# Altium schematic sheet sensors-ssm.SchDoc
size A4
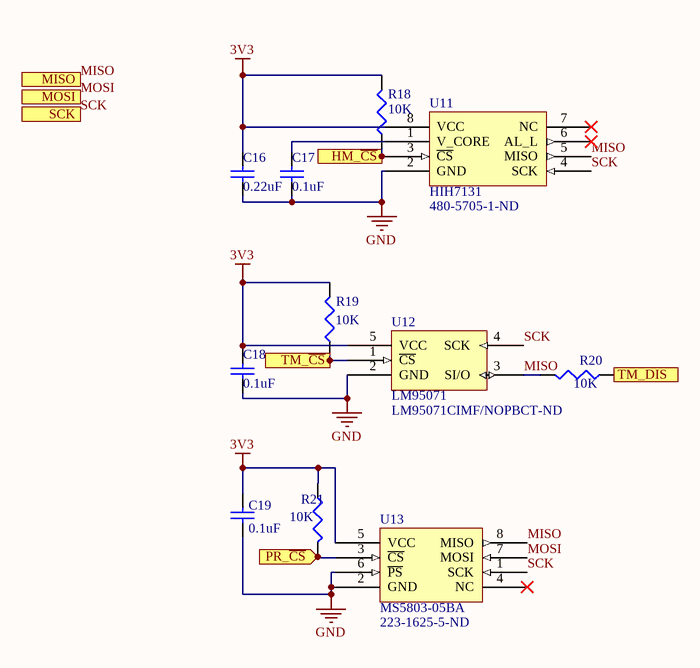
[diagram p0: sensors-ssm.SchDoc]

## Parts
C16  value 0.22uF  [C1206]  (hidden comment: Cap Semi)
C17  value 0.1uF  [C1206]  (hidden comment: Cap Semi)
C18  value 0.1uF  [C1206]  (hidden comment: Cap Semi)
C19  value 0.1uF  [C1206]  (hidden comment: Cap Semi)
R18  value 10K  [J1-0603]  (hidden comment: Res3)
R19  value 10K  [J1-0603]  (hidden comment: Res3)
R20  value 10K  [J1-0603]  (hidden comment: Res3)
R21  value 10K  [J1-0603]  (hidden comment: Res3)
U11  HIH7131  Supplier Part Number 1: 480-5705-1-ND  [SOIC127P500X600-8N]
U12  LM95071  Supplier Part Number 1: LM95071CIMF/NOPBCT-ND  [SOT-23-5_95P290X160-5N]
U13  MS5803-05BA  Supplier Part Number 1: 223-1625-5-ND  [MS5803-05BA_125P640x620-8N]

## Ports
HM_~{CS} (in), MISO (out), MOSI (in), PR_~{CS} (in), SCK (in), TM_DIS (in), TM_~{CS} (in)

## Nets
3V3: C16.2 C18.2 C19.2 R18.2 R19.2 R21.1 U11.8(VCC) U12.5(VCC) U13.5(VCC)
GND: C16.1 C17.1 C18.1 C19.1 U11.2(GND) U12.2(GND) U13.2(GND) U13.6(~{PS})
HM_~{CS}: R18.1 U11.3(~{CS}) ; port HM_~{CS}
MISO: R20.2 U11.5(MISO) U12.3(SI/O) U13.8(MISO) ; port MISO
MOSI: U13.7(MOSI) ; port MOSI
PR_~{CS}: R21.2 U13.3(~{CS}) ; port PR_~{CS}
SCK: U11.4(SCK) U12.4(SCK) U13.1(SCK) ; port SCK
TM_~{CS}: R19.1 U12.1(~{CS}) ; port TM_~{CS}
TM_DIS: R20.1 ; port TM_DIS
NetC17_2: C17.2 U11.1(V_CORE)

Not connected (* = marked no-connect by the designer): U11 6(AL_L)* 7(NC)*; U13 4(NC)*

## Library data of the parts
C16-C19 = Cap Semi: Capacitor (Semiconductor SIM Model); Published: 8-Jun-2000; LatestRevisionDate: 29-May-2009; LatestRevisionNote: IPC-7351 Footprint Added.; PackageReference: C1206; Publisher: Altium Limited; PackageDescription: Chip Capacitor
R18-R21 = Res3: Resistor; Published: 8-Jun-2000; LatestRevisionDate: 29-May-2009; LatestRevisionNote: IPC-7351 Footprint Added.; PackageReference: J1-0603; Publisher: Altium Limited; PackageDescription: Chip Resistor
U11 = HIH7131: Digital humidity/temperature sensors. +/- 3% RH, 0-100%, SPI output. Model version with filter and condensation resistant.; Supplier 1: Digi-Key
U12 = LM95071: 13 bit plus sign digital temperature sensor. Nominal +/- 1 C accuracy from 0-70 C.; Supplier 1: Digi-Key
U13 = MS5803-05BA: Digital 24-bit pressure sensor with SPI output. Operating range from 0-5bar, includes onboard temperature sensor and hermetic seal.; Supplier 1: Digi-Key